# Altium schematic sheet estop_circuitry.SchDoc
size Letter; CompanyName: Carnegie Mellon University; Organization: Carnegie Mellon University; Address1: Carnegie Mellon University; Address2: Robotics Institute; Address3: 5000 Forbes Ave., 4208 NSH; Address4: Pittsburgh, PA 15213; DocumentNumber: 3; Revision: 1.0; SheetNumber: 3; SheetTotal: 8; PageSetup: Record=PageOptions|CenterHorizontal=True|CenterVertical=True|PrintScale=1.00|XCorrection=1.00|YCorrection=1.00|PrintKind=0|BorderSize=5000000|LeftOffset=0|BottomOffset=0|Orientation=2|PaperLength=1000|PaperWidth=1000|Scale=100|PaperSource=7|PrintQuality=-4|MediaType=1|DitherType=10|PaperKind=Letter|PrintScaleMode=1
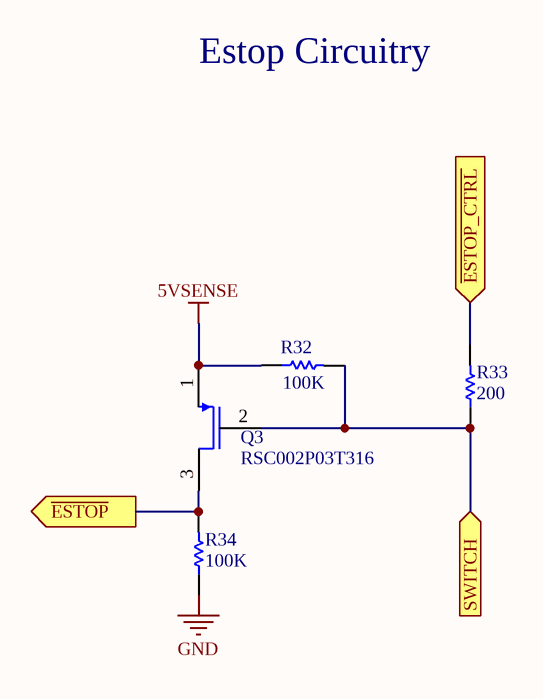
[diagram p0: estop_circuitry.SchDoc]

## Parts
Q3  RSC002P03T316  [SOT-23]
R32  100K  [RESC1608N]
R33  200  [RESC1608N]
R34  100K  [RESC1608N]

## Ports
SWITCH (in), ~{ESTOP_CTRL} (in), ~{ESTOP} (out)

## Nets
5VSENSE: Q3.1 R32.1
GND: R34.1
~{ESTOP}: Q3.3 R34.2 ; port ~{ESTOP}
~{ESTOP_CTRL}: R33.2 ; port ~{ESTOP_CTRL}
SWITCH: Q3.2 R32.2 R33.1 ; port SWITCH

## Notes on the sheet
- Estop Circuitry
- Title
- Size:
- Date:
- Letter
- Number:
- Time:
- Revision:
- Sheet
- of
- File:

## Library data of the parts
Q3 = RSC002P03T316: P-Channel MOSFET; pin to pad: 1>2 2>1; Manufacturer: Rohm Semiconductor; Description: MOSFET P-CH 30V 0.25A SST3; FET Type: MOSFET P-Channel, Metal Oxide; FET Feature: Logic Level Gate, 4V Drive; Drain to Source Voltage (Vdss): 30V; Current - Continuous Drain (Id) @ 25°C: 250mA (Ta); Rds On (Max) @ Id, Vgs: 1.4 Ohm @ 250mA, 10V; Vgs(th) (Max) @ Id: 2.5V @ 1mA; Input Capacitance (Ciss) @ Vds: 30pF @ 10V; Power - Max: 200mW; Supplier 1: Digi-Key; Supplier Part Number 1: RSC002P03T316CT-ND; Manufacturer Part Number: RSC002P03T316; RoHS: RoHS Compliant; Category: Discrete Semiconductor Products; Stock 1: 8983; Pricing 1: 1=0.27, 10=0.222, 100=0.1174, 500=0.0772, 1000=0.0526 (USD); Packaging: Cut Tape (CT); Gate Charge (Qg) @ Vgs: -; Operating Temperature: 150°C (TJ); Mounting Type: Surface Mount; Package / Case: TO-236-3, SC-59, SOT-23-3; Supplier Device Package: SST3; ComponentLink1URL: http://rohmfs.rohm.com/en/products/databook/datasheet/discrete/transistor/mosfet/rsc002p03.pdf; ComponentLink1Description: http://rohmfs.rohm.com/en/products/databook/datasheet/discrete/transistor/mosfet/rsc002p03.pdf
R32 R34 = Res1: Resistor; Manufacturer: Yageo; Manufacturer Part Number: RC0603JR-07100KL; Description: RES SMD 100K OHM 5% 1/10W 0603; Tolerance: ±5%; Power (Watts): 0.1W, 1/10W; Temperature Coefficient: ±100ppm/°C; Published: 8-Jun-2000; LatestRevisionDate: 17-Jul-2002; LatestRevisionNote: Re-released for DXP Platform.; PackageReference: AXIAL-0.3; Publisher: Altium Limited; PackageDescription: Axial Device, Thru-Hole; 2 Leads; 0.3 in Pin Spacing; Value: 100K; Supplier 1: Digi-Key; Supplier Part Number 1: 311-100KGRCT-ND; RoHS: RoHS Compliant; Category: Resistors; Stock 1: 1162719; Pricing 1: 1=0.1, 10=0.011, 25=0.008, 100=0.0044, 250=0.00336, 500=0.0027, 1000=0.00198, 2500=0.00172 (USD); Packaging: Cut Tape (CT); Resistance (Ohms): 100k; Composition: Thick Film; Features: Moisture Resistant; Operating Temperature: -55°C ~ 155°C; Package / Case: 0603 (1608 Metric); Supplier Device Package: 0603; Size / Dimension: 0.063" L x 0.031" W (1.60mm x 0.80mm); Height: 0.022" (0.55mm); Number of Terminations: 2; ComponentLink1URL: http://www.yageo.com/documents/recent/PYu-RC_Group_51_RoHS_L_04.pdf; ComponentLink1Description: http://www.yageo.com/documents/recent/PYu-RC_Group_51_RoHS_L_04.pdf
R33 = Res1: Resistor; Manufacturer: Yageo; Manufacturer Part Number: RC0603JR-07200RL; Description: RES SMD 200 OHM 5% 1/10W 0603; Tolerance: ±5%; Power (Watts): 0.1W, 1/10W; Temperature Coefficient: ±100ppm/°C; Published: 8-Jun-2000; LatestRevisionDate: 17-Jul-2002; LatestRevisionNote: Re-released for DXP Platform.; PackageReference: AXIAL-0.3; Publisher: Altium Limited; PackageDescription: Axial Device, Thru-Hole; 2 Leads; 0.3 in Pin Spacing; Value: 200; Supplier 1: Digi-Key; Supplier Part Number 1: 311-200GRCT-ND; RoHS: RoHS Compliant; Category: Resistors; Stock 1: 267996; Pricing 1: 1=0.1, 10=0.011, 25=0.008, 100=0.0044, 250=0.00336, 500=0.0027, 1000=0.00198, 2500=0.00172 (USD); Packaging: Cut Tape (CT); Resistance (Ohms): 200; Composition: Thick Film; Features: Moisture Resistant; Operating Temperature: -55°C ~ 155°C; Package / Case: 0603 (1608 Metric); Supplier Device Package: 0603; Size / Dimension: 0.063" L x 0.031" W (1.60mm x 0.80mm); Height: 0.022" (0.55mm); Number of Terminations: 2; ComponentLink1URL: http://www.yageo.com/documents/recent/PYu-RC_Group_51_RoHS_L_04.pdf; ComponentLink1Description: http://www.yageo.com/documents/recent/PYu-RC_Group_51_RoHS_L_04.pdf